# Altium schematic sheet TSI_SAMP_SAMI_V3.4.SchDoc (part 1 of 2)
size 863 x 558 mm; SheetNumber: 1; SheetTotal: 1
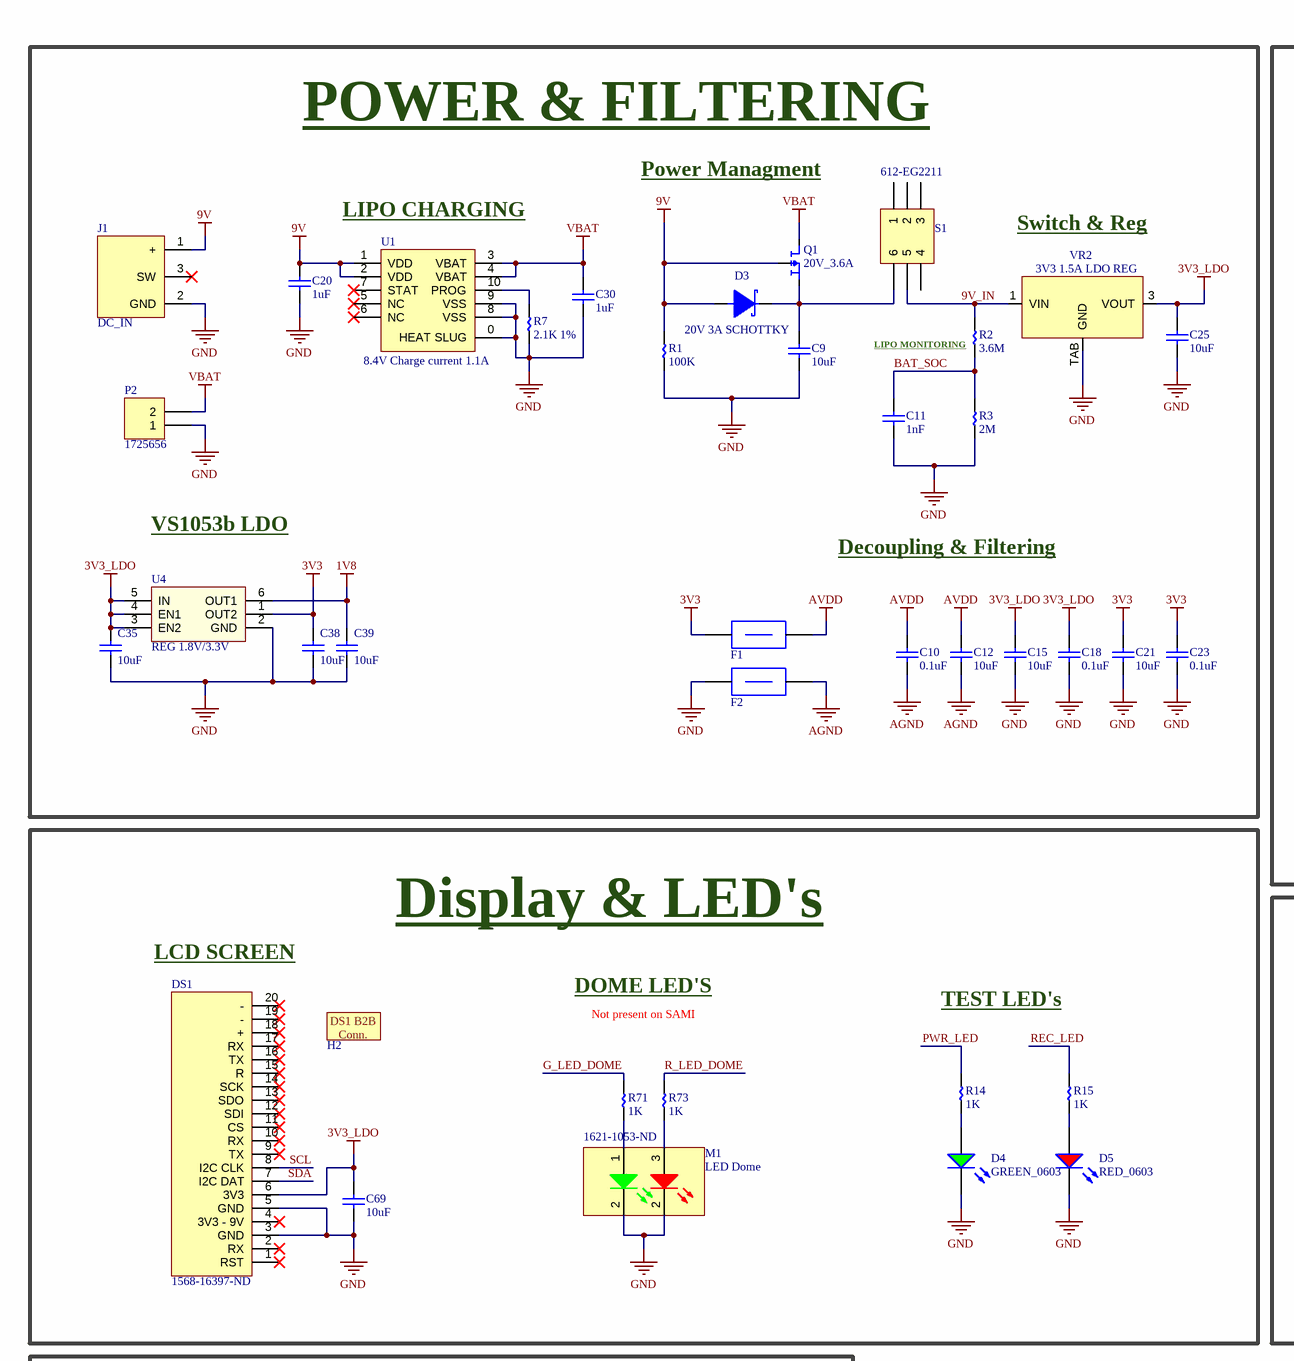
[diagram p0: TSI_SAMP_SAMI_V3.4.SchDoc, top left]
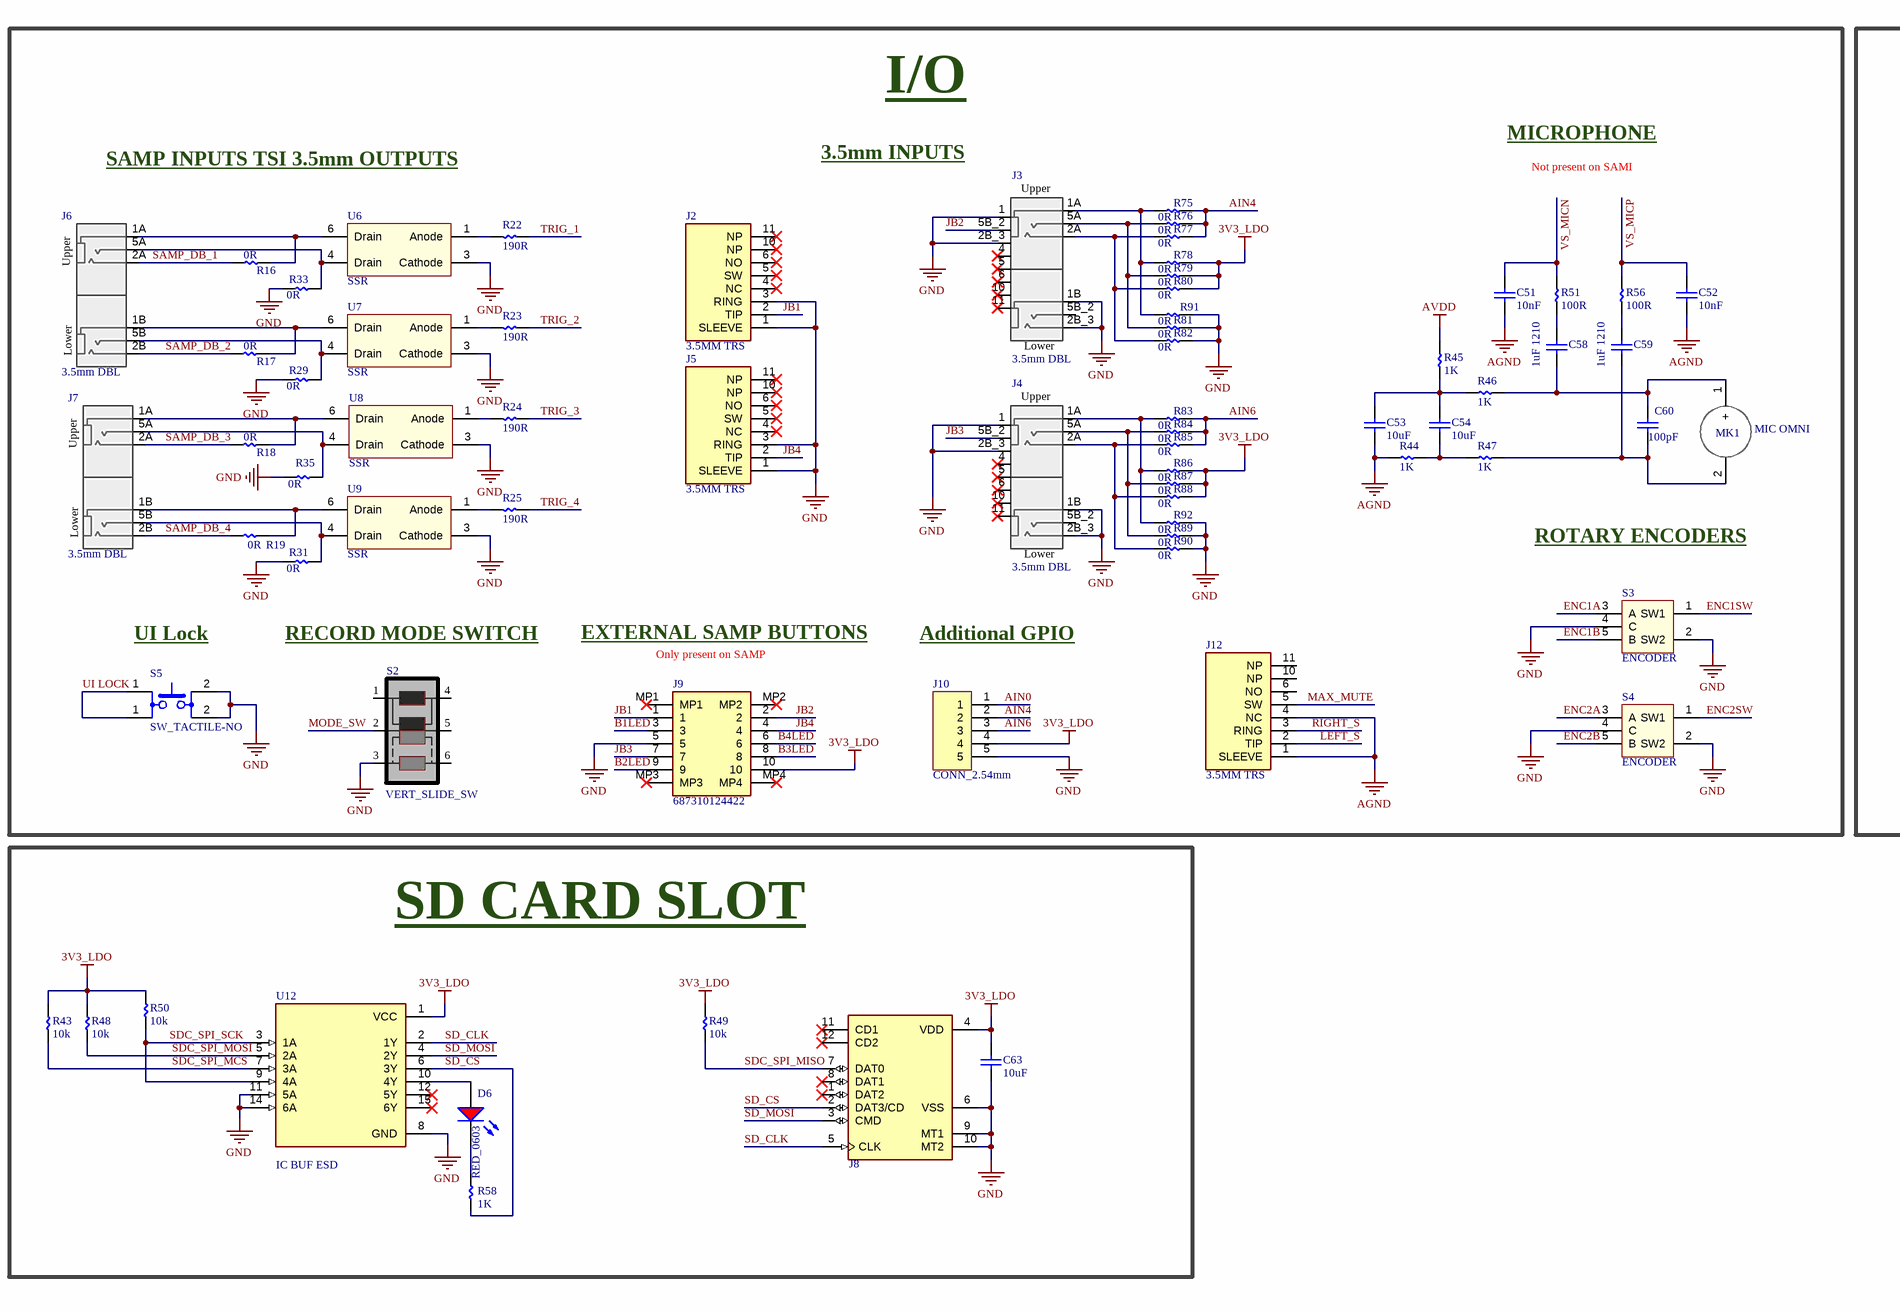
[diagram p1: TSI_SAMP_SAMI_V3.4.SchDoc, top middle]
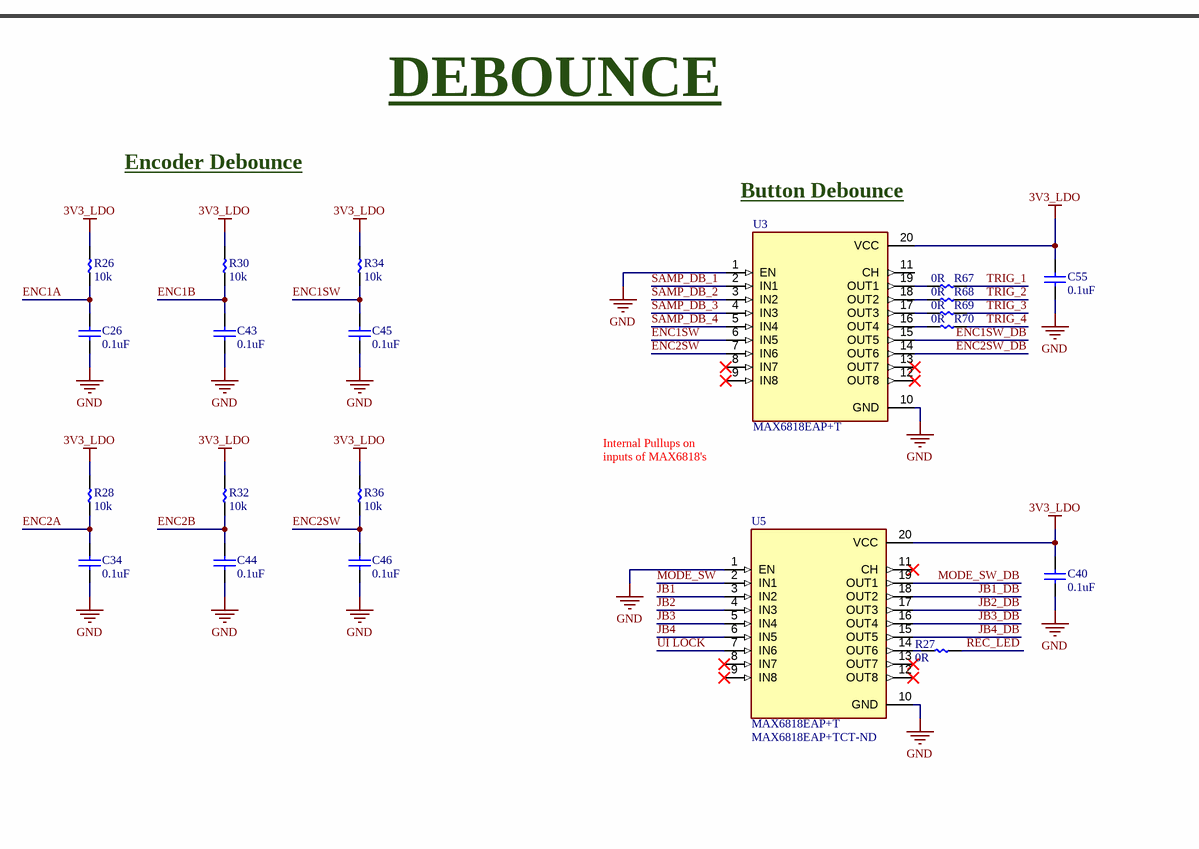
[diagram p2: TSI_SAMP_SAMI_V3.4.SchDoc, top right]
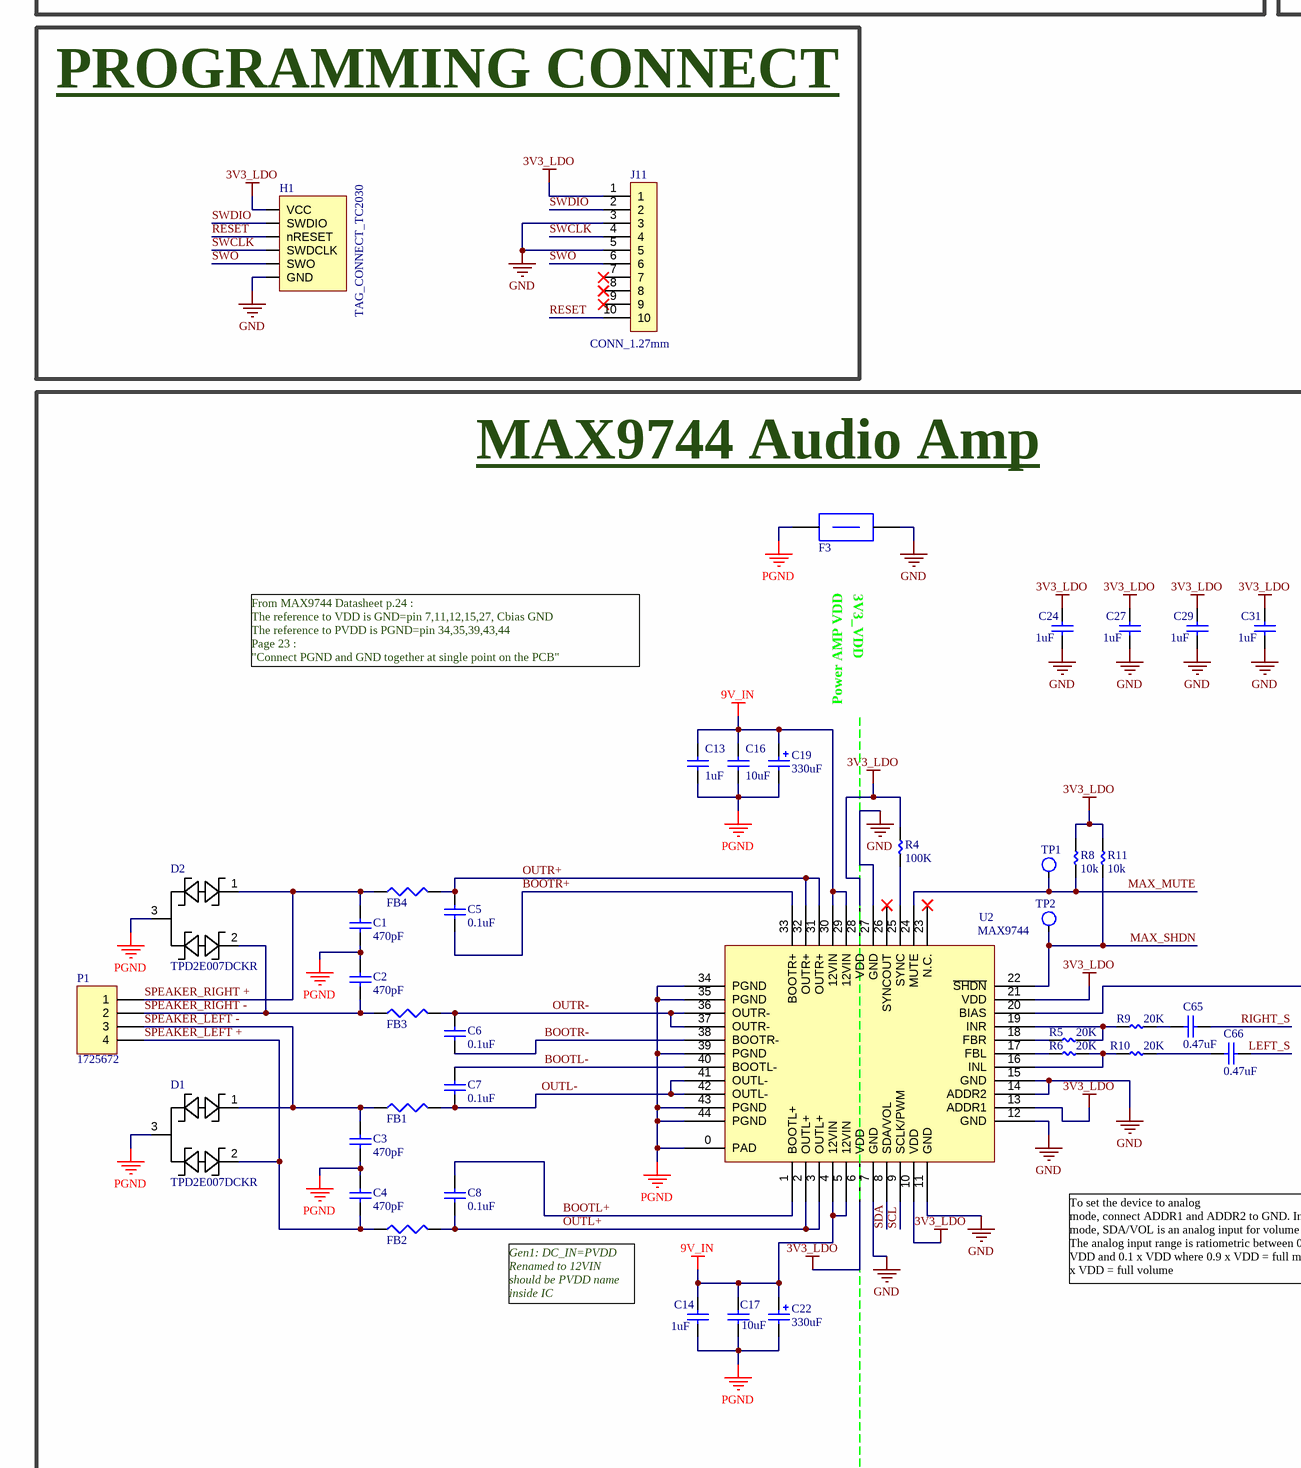
[diagram p3: TSI_SAMP_SAMI_V3.4.SchDoc, bottom left]
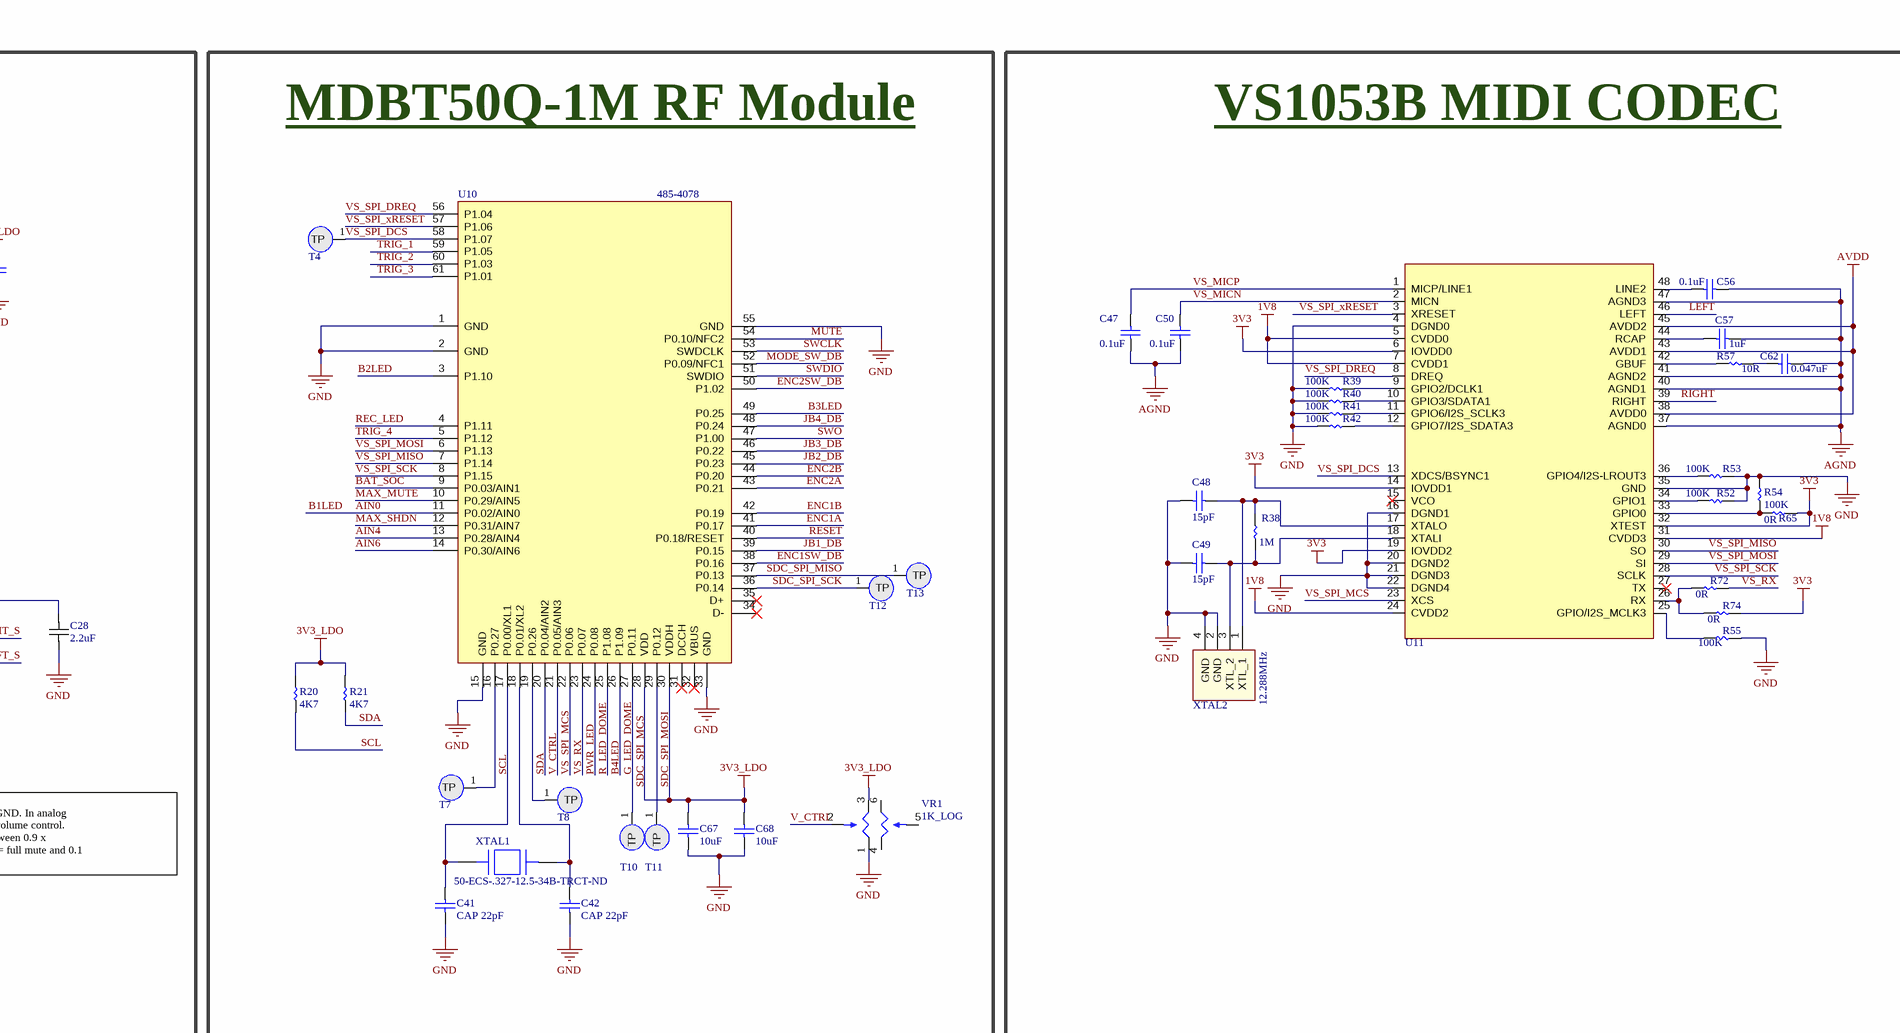
[diagram p4: TSI_SAMP_SAMI_V3.4.SchDoc, bottom middle]
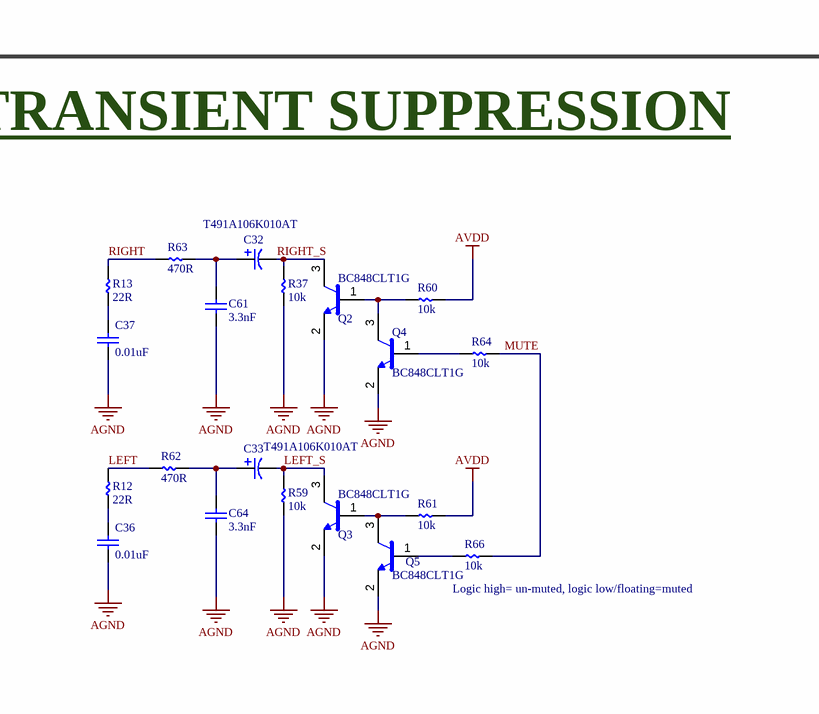
[diagram p5: TSI_SAMP_SAMI_V3.4.SchDoc, bottom right]

## Parts
C1  470pF  [Cap_0603_M]
C2  470pF  [Cap_0603_M]
C3  470pF  [Cap_0603_M]
C4  470pF  [Cap_0603_M]
C5  0.1uF  [Cap_0603_M]
C6  0.1uF  [Cap_0603_M]
C7  0.1uF  [Cap_0603_M]
C8  0.1uF  [Cap_0603_M]
C9  10uF  [Cap_0603_M]
C10  0.1uF  [Cap_0603_M]
C11  1nF  [Cap_0603_M]
C12  10uF  [Cap_0603_M]
C13  1uF  [Cap_0603_M]
C14  1uF  [Cap_0603_M]
C15  10uF  [Cap_0603_M]
C16  10uF  [CAP-1206]
C17  10uF  [CAP-1206]
C18  0.1uF  [Cap_0603_M]
C19  330uF  [CAP ALUM 330UF 20% 50V SMD]
C20  1uF  [Cap_0603_M]
C21  10uF  [Cap_0603_M]
C22  330uF  [CAP ALUM 330UF 20% 50V SMD]
C23  0.1uF  [Cap_0603_M]
C24  1uF  [Cap_0603_M]
C25  10uF  [Cap_0603_M]
C26  0.1uF  [Cap_0603_M]
C27  1uF  [Cap_0603_M]
C28  2.2uF  [Cap_0603_M]
C29  1uF  [Cap_0603_M]
C30  1uF  [Cap_0603_M]
C31  1uF  [Cap_0603_M]
C32  T491A106K010AT  [CAPMP3.4X1.6_1.8N_KEM-M]
C33  T491A106K010AT  [CAPMP3.4X1.6_1.8N_KEM-M]
C34  0.1uF  [Cap_0603_M]
C35  10uF  [Cap_0603_M]
C36  0.01uF  [Cap_0603_M]
C37  0.01uF  [Cap_0603_M]
C38  10uF  [Cap_0603_M]
C39  10uF  [Cap_0603_M]
C40  0.1uF  [Cap_0603_M]
C41  CAP 22pF  [Cap_0603_M]
C42  CAP 22pF  [Cap_0603_M]
C43  0.1uF  [Cap_0603_M]
C44  0.1uF  [Cap_0603_M]
C45  0.1uF  [Cap_0603_M]
C46  0.1uF  [Cap_0603_M]
C47  0.1uF  [Cap_0603_M]
C48  15pF  [Cap_0603_M]
C49  15pF  [Cap_0603_M]
C50  0.1uF  [Cap_0603_M]
C51  10nF  [Cap_0603_M]
C52  10nF  [Cap_0603_M]
C53  10uF  [Cap_0603_M]
C54  10uF  [Cap_0603_M]
C55  0.1uF  [Cap_0603_M]
C56  0.1uF  [Cap_0603_M]
C57  1uF  [Cap_0603_M]
C58  1uF 1210  [CAP_1210_N]
C59  1uF 1210  [CAP_1210_N]
C60  100pF  [Cap_0603_M]
C61  3.3nF  [Cap_0603_M]
C62  0.047uF  [Cap_0603_M]
C63  10uF  [Cap_0603_M]
C64  3.3nF  [Cap_0603_M]
C65  0.47uF  [Cap_0603_M]
C66  0.47uF  [Cap_0603_M]
C67  10uF  [Cap_0603_M]
C68  10uF  [Cap_0603_M]
C69  10uF  [Cap_0603_M]
D1  TPD2E007DCKR  [SOT-SC70]
D2  TPD2E007DCKR  [SOT-SC70]
D3  20V 3A SCHOTTKY  [SCHOTTKY_20V_3A_SMB]
D4  GREEN_0603  [LED_0603_SMD]
D5  RED_0603  [LED_0603_SMD]
D6  RED_0603  [LED_0603_SMD]
DS1  Supplier Part Number 1: 1568-16397-ND  [LCD_Screen_16x2]  (hidden comment: LCD_Screen_16x2)
F1  FERRITE BEAD  [FER_8A_4mOHM_0603]  (value not drawn)
F2  FERRITE BEAD  [FER_8A_4mOHM_0603]  (value not drawn)
F3  FERRITE BEAD  [FER_8A_4mOHM_0603]  (value not drawn)
FB1  220R 3A  [FB_0805]  (value not drawn)
FB2  220R 3A  [FB_0805]  (value not drawn)
FB3  220R 3A  [FB_0805]  (value not drawn)
FB4  220R 3A  [FB_0805]  (value not drawn)
H1  TAG_CONNECT_TC2030  [TAG_CONNECT_TC2030]
H2  16-Pin_B2B  (value not drawn)  (mechanical)
J1  DC_IN  [CONN_DC_JACK_2.1mmID_5.5mmOD_RA_TH]
J2  3.5MM TRS  [CONN_JACK_STEREO_3.5MM_SPDT_RA]
J3  3.5mm DBL  [CONN_3.5MM_COMBO]
J4  3.5mm DBL  [CONN_3.5MM_COMBO]
J5  3.5MM TRS  [CONN_JACK_STEREO_3.5MM_SPDT_RA]
J6  3.5mm DBL  [CONN_3.5MM_STEREO_DBL_VERT_TH]
J7  3.5mm DBL  [CONN_3.5MM_STEREO_DBL_VERT_TH]
J8  CONN_SD_CARD_SMD  [CONN_SD_CARD_SMD]  (value not drawn)
J9  687310124422  [687310124422]
J10  CONN_2.54mm  [HDRV5W67P0X254_1X5_1270X241X858P]
J11  CONN_1.27mm  [CONN_10x_3220-10-0300-00]
J12  3.5MM TRS  [CONN_JACK_STEREO_3.5MM_SPDT_RA]
M1  LED Dome  Supplier Part Number 1: 1621-1053-ND  [LED_Dome_4LED]
MK1  MIC OMNI  [MIC_ELECTRET_CASTLE PAD]
P1  1725672  [1725672]
P2  1725656  [1725656]
Q1  20V_3.6A  [MOSFET_P-CH_20V_SOT23]
Q2  BC848CLT1G  [onSemi_SOT-23_N]
Q3  BC848CLT1G  [onSemi_SOT-23_N]
Q4  BC848CLT1G  [onSemi_SOT-23_N]
Q5  BC848CLT1G  [onSemi_SOT-23_N]
R1  100K  [Res_0603_M]
R2  3.6M  [Res_0603_M]
R3  2M  [Res_0603_M]
R4  100K  [Res_0603_M]
R5  20K  [Res_0603_M]
R6  20K  [Res_0603_M]
R7  2.1K 1%  [Res_0603_M]
R8  10k  [Res_0603_M]
R9  20K  [Res_0603_M]
R10  20K  [Res_0603_M]
R11  10k  [Res_0603_M]
R12  22R  [Res_0603_M]
R13  22R  [Res_0603_M]
R14  1K  [Res_0603_M]
R15  1K  [Res_0603_M]
R16  0R  [Res_0603_M]
R17  0R  [Res_0603_M]
R18  0R  [Res_0603_M]
R19  0R  [Res_0603_M]
R20  4K7  [Res_0603_M]
R21  4K7  [Res_0603_M]
R22  190R  [Res_0603_M]
R23  190R  [Res_0603_M]
R24  190R  [Res_0603_M]
R25  190R  [Res_0603_M]
R26  10k  [Res_0603_M]
R27  0R  [Res_0603_M]
R28  10k  [Res_0603_M]
R29  0R  [Res_0603_M]
R30  10k  [Res_0603_M]
R31  0R  [Res_0603_M]
R32  10k  [Res_0603_M]
R33  0R  [Res_0603_M]
R34  10k  [Res_0603_M]
R35  0R  [Res_0603_M]
R36  10k  [Res_0603_M]
R37  10k  [Res_0603_M]
R38  1M  [Res_0603_M]
R39  100K  [Res_0603_M]
R40  100K  [Res_0603_M]
R41  100K  [Res_0603_M]
R42  100K  [Res_0603_M]
R43  10k  [Res_0603_M]
R44  1K  [Res_0603_M]
R45  1K  [Res_0603_M]
R46  1K  [Res_0603_M]
R47  1K  [Res_0603_M]
R48  10k  [Res_0603_M]
R49  10k  [Res_0603_M]
R50  10k  [Res_0603_M]
R51  100R  [Res_0603_M]
R52  100K  [Res_0603_M]
R53  100K  [Res_0603_M]
R54  100K  [Res_0603_M]
R55  100K  [Res_0603_M]
R56  100R  [Res_0603_M]
R57  10R  [Res_0603_M]
R58  1K  [Res_0603_M]
R59  10k  [Res_0603_M]
R60  10k  [Res_0603_M]
R61  10k  [Res_0603_M]
R62  470R  [Res_0603_M]
R63  470R  [Res_0603_M]
R64  10k  [Res_0603_M]
R65  0R  [Res_0603_M]
R66  10k  [Res_0603_M]
R67  0R  [Res_0603_M]
R68  0R  [Res_0603_M]
R69  0R  [Res_0603_M]
R70  0R  [Res_0603_M]
R71  1K  [Res_0603_M]
R72  0R  [Res_0603_M]
R73  1K  [Res_0603_M]
R74  0R  [Res_0603_M]
R75  0R  [Res_0603_M]
R76  0R  [Res_0603_M]
R77  0R  [Res_0603_M]
R78  0R  [Res_0603_M]
R79  0R  [Res_0603_M]
R80  0R  [Res_0603_M]
R81  0R  [Res_0603_M]
R82  0R  [Res_0603_M]
R83  0R  [Res_0603_M]
R84  0R  [Res_0603_M]
R85  0R  [Res_0603_M]
R86  0R  [Res_0603_M]
R87  0R  [Res_0603_M]
R88  0R  [Res_0603_M]
R89  0R  [Res_0603_M]
R90  0R  [Res_0603_M]
R91  0R  [Res_0603_M]
R92  0R  [Res_0603_M]
S1  Supplier Part Number 1: 612-EG2211  [SW_SLIDE_RA_TH_DPDT]  (hidden comment: SWITCH SLIDE DPDT 200MA 30V)
S2  VERT_SLIDE_SW  [SW_SLIDE_SPDT_VERT_TH]
S3  ENCODER  [ENC_ROTARY_20PPR_TH]
S4  ENCODER  [ENC_ROTARY_20PPR_TH]
S5  SW_TACTILE-NO  [SW_TACTILE_SPST-NO]
T4  CONN_TP_SMD  [CONN_TP_SMD]  (value not drawn)
T7  CONN_TP_SMD  [CONN_TP_SMD]  (value not drawn)
T8  CONN_TP_SMD  [CONN_TP_SMD]  (value not drawn)
T10  CONN_TP_SMD  [CONN_TP_SMD]  (value not drawn)
T11  CONN_TP_SMD  [CONN_TP_SMD]  (value not drawn)
T12  CONN_TP_SMD  [CONN_TP_SMD]  (value not drawn)
T13  CONN_TP_SMD  [CONN_TP_SMD]  (value not drawn)
TP1  Test Point  [TEST POINT ROUND SMD 0.6mm]  (value not drawn)  (no BOM)
TP2  Test Point  [TEST POINT ROUND SMD 0.6mm]  (value not drawn)  (no BOM)
U1  8.4V Charge current 1.1A  [LIPO-CHARGING_8.4V_10DFN]
U2  MAX9744  [MAX9744_T4477]
U3  MAX6818EAP+T  [IC_DEBOUNCE_8IN8OUT_SMD]
U4  REG 1.8V/3.3V  [IC_REG_LINEAR_3V3_1V8_SMD]
U5  MAX6818EAP+T  Supplier Part Number 1: MAX6818EAP+TCT-ND  [IC_DEBOUNCE_8IN8OUT_SMD]
U6  SSR  [IC_SSR_NO_SMD]
U7  SSR  [IC_SSR_NO_SMD]
U8  SSR  [IC_SSR_NO_SMD]
U9  SSR  [IC_SSR_NO_SMD]
U10  Supplier Part Number 1: 485-4078  [IC_MDBT50Q-1M_SMD]  (hidden comment: IC_MDBT50Q-1M_SMD)
U11  IC_VS1053B_LQFP48  [IC_VS1053B_LQFP48]  (value not drawn)
U12  IC BUF ESD  [IC_BUF_ESD_CD74HC4050MT]
VR1  1K_LOG  [POT_1K_LOG_TH_RA]
VR2  3V3 1.5A LDO REG  [REG_3.3V_D2PAK]
XTAL1  50-ECS-.327-12.5-34B-TRCT-ND  [XTAL-32.768kHz]
XTAL2  12.288MHz  [XTAL_12.288MHz_SMD]

## Blocks framed on the sheet
POWER & FILTERING: C9-C12 C15 C18 C20 C21 C23 C25 C30 C35 C38 C39 D3 F1 F2 J1 P2 Q1 R1-R3 R7 S1 U1 U4 VR2
I/O: C51-C54 C58-C60 J2-J7 J9 J10 J12 MK1 R16-R19 R22-R25 R29 R31 R33 R35 R44-R47 R51 R56 R75-R92 S2-S5 U6-U9
DEBOUNCE: C26 C34 C40 C43-C46 C55 R26-R28 R30 R32 R34 R36 R67-R70 U3 U5
Display & LED's: C69 D4 D5 DS1 H2 M1 R14 R15 R71 R73
SD CARD SLOT: C63 D6 J8 R43 R48-R50 R58 U12
PROGRAMMING CONNECT: H1 J11
MAX9744 Audio Amp: C1-C8 C13 C14 C16 C17 C19 C22 C24 C27-C29 C31 C65 C66 D1 D2 F3 FB1-FB4 P1 R4-R6 R8-R11 TP1 TP2 U2
MDBT50Q-1M RF Module: C41 C42 C67 C68 R20 R21 T4 T7 T8 T10-T13 U10 VR1 XTAL1
VS1053B MIDI CODEC: C47-C50 C56 C57 C62 R38-R42 R52-R55 R57 R65 R72 R74 U11 XTAL2
TRANSIENT SUPPRESSION: C32 C33 C36 C37 C61 C64 Q2-Q5 R12 R13 R37 R59-R64 R66

## Nets
1V8: C39.2 U4.6(OUT1) U11.5(CVDD0) U11.7(CVDD1) U11.24(CVDD2) U11.31(CVDD3)
3V3: C21.2 C23.2 C38.2 F1.1 R65.2 R74.2 U4.1(OUT2) U11.6(IOVDD0) U11.14(IOVDD1) U11.19(IOVDD2) U11.32(XTEST)
3V3_LDO: C15.2 C18.2 C24.2 C25.2 C27.2 C29.2 C31.2 C35.2 C40.2 C55.2 C63.2 C67.2 C68.2 C69.2 DS1.6(3V3) H1.1(VCC) J8.4(VDD) J9.10 J10.4 J11.1 R4.2 R8.1 R11.1 R20.1 R21.1 R26.1 R28.1 R30.1 R32.1 R34.1 R36.1 R43.1 R48.1 R49.1 R50.1 R78.2 R79.2 R80.2 R86.2 R87.2 R88.2 U2.6(VDD) U2.10(VDD) U2.13(ADDR1) U2.21(VDD) U2.28(VDD) U3.20(VCC) U4.3(EN2) U4.4(EN1) U4.5(IN) U5.20(VCC) U10.28(VDD) U10.30(VDDH) U12.1(VCC) VR1.3 VR2.3(VOUT)
9V: C20.2 D3.1(ANODE) J1.1(+) Q1.1(G) R1.1 U1.1(VDD) U1.2(VDD)
9V_IN: C13.2 C14.2 C16.2 C17.2 C19.1 C22.1 R2.1 S1.5 U2.4(12VIN) U2.5(12VIN) U2.29(12VIN) U2.30(12VIN) VR2.1(VIN)
AGND: C10.1 C12.1 C36.1 C37.1 C47.1 C50.1 C51.1 C52.1 C53.1 C56.2 C57.2 C61.1 C62.1 C64.1 F2.2 J12.1(SLEEVE) J12.4(NC) Q2.2(E) Q3.2(E) Q4.2(E) Q5.2(E) R37.2 R44.2 R59.2 U11.37(AGND0) U11.40(AGND1) U11.41(AGND2) U11.47(AGND3)
AVDD: C10.2 C12.2 F1.2 R45.1 R60.2 R61.2 U11.38(AVDD0) U11.43(AVDD1) U11.45(AVDD2)
GND: C9.1 C11.1 C15.1 C18.1 C20.1 C21.1 C23.1 C24.1 C25.1 C26.1 C27.1 C28.1 C29.1 C30.1 C31.1 C34.1 C35.1 C38.1 C39.1 C40.1 C41.1 C42.1 C43.1 C44.1 C45.1 C46.1 C48.1 C49.2 C55.1 C63.1 C67.1 C68.1 C69.1 D4.2(K) D5.2(K) DS1.3(GND) DS1.5(GND) F2.1 F3.2 H1.5(GND) J1.2(GND) J2.1(SLEEVE) J2.3(RING) J3.1 J3.1B J3.2B_3 J4.1 J4.1B J4.2B_3 J5.1(SLEEVE) J5.3(RING) J8.6(VSS) J8.9(MT1) J8.10(MT2) J9.5 J10.5 J11.3 J11.5 M1.2 P2.1 R1.2 R3.2 R7.2 R29.1 R31.1 R33.1 R35.1 R39.2 R40.2 R41.2 R42.2 R52.1 R53.1 R54.1 R55.1 R81.2 R82.2 R89.2 R90.2 R91.2 R92.2 S2.3 S3.2(SW2) S3.4(C) S4.2(SW2) S4.4(C) S5.2 U1.0(HEAT_SLUG) U1.8(VSS) U1.9(VSS) U2.7(GND) U2.11(GND) U2.12(GND) U2.14(ADDR2) U2.15(GND) U2.27(GND) U3.1(EN) U3.10(GND) U4.2(GND) U5.1(EN) U5.10(GND) U6.3(Cathode) U7.3(Cathode) U8.3(Cathode) U9.3(Cathode) U10.1(GND) U10.2(GND) U10.15(GND) U10.33(GND) U10.55(GND) U11.4(DGND0) U11.16(DGND1) U11.20(DGND2) U11.21(DGND3) U11.22(DGND4) U11.35(GND) U12.8(GND) U12.11(5A) U12.14(6A) VR1.1 VR2.TAB(GND) XTAL2.2(GND) XTAL2.4(GND)
PGND: C1.1 C2.2 C3.1 C4.2 C13.1 C14.1 C16.1 C17.1 C19.2 C22.2 D1.3(GND) D2.3(GND) F3.1 U2.0(PAD) U2.34(PGND) U2.35(PGND) U2.39(PGND) U2.43(PGND) U2.44(PGND)
VBAT: C30.2 P2.2 Q1.2(S) U1.3(VBAT) U1.4(VBAT)
AIN0: J9.3 J10.1 U10.11(P0.02/AIN0)  [also labelled B1LED]
AIN4: J10.2 R75.2 R76.2 R77.2 U10.13(P0.28/AIN4)
AIN6: J10.3 R83.2 R84.2 R85.2 U10.14(P0.30/AIN6)
B2LED: J9.9 U10.3(P1.10)
B3LED: J9.8 U10.49(P0.25)
B4LED: J9.6 U10.25(P1.08)
BAT_SOC: C11.2 R2.2 R3.1 U10.9(P0.03/AIN1)
BOOTL+: C8.2 U2.1(BOOTL+)
BOOTL-: C7.2 U2.40(BOOTL-)
BOOTR+: C5.1 U2.33(BOOTR+)
BOOTR-: C6.1 U2.38(BOOTR-)
ENC1A: C26.2 R26.2 S3.3(A) U10.41(P0.17)
ENC1B: C43.2 R30.2 S3.5(B) U10.42(P0.19)
ENC1SW: C45.2 R34.2 S3.1(SW1) U3.6(IN5)
ENC1SW_DB: U3.15(OUT5) U10.38(P0.16)
ENC2A: C34.2 R28.2 S4.3(A) U10.43(P0.21)
ENC2B: C44.2 R32.2 S4.5(B) U10.44(P0.20)
ENC2SW: C46.2 R36.2 S4.1(SW1) U3.7(IN6)
ENC2SW_DB: U3.14(OUT6) U10.50(P1.02)
G_LED_DOME: R71.1 U10.26(P1.09)
JB1: J2.2(TIP) J9.1 U5.3(IN2)
JB1_DB: U5.18(OUT2) U10.39(P0.15)
JB2: J3.5B_2 J9.2 U5.4(IN3)
JB2_DB: U5.17(OUT3) U10.45(P0.23)
JB3: J4.5B_2 J9.7 U5.5(IN4)
JB3_DB: U5.16(OUT4) U10.46(P0.22)
JB4: J5.2(TIP) J9.4 U5.6(IN5)
JB4_DB: U5.15(OUT5) U10.48(P0.24)
LEFT: R12.1 R62.2 U11.46(LEFT)
LEFT_S: C33.2 C66.1 J12.2(TIP) Q3.3(C) R59.1
MAX_MUTE: J12.5(SW) R8.2 TP1.1 U2.24(MUTE) U10.10(P0.29/AIN5)
MAX_SHDN: R11.2 TP2.1 U2.22(~{SHDN}) U10.12(P0.31/AIN7)
MODE_SW: S2.2 U5.2(IN1)
MODE_SW_DB: U5.19(OUT1) U10.52(P0.09/NFC1)
MUTE: R64.2 R66.2 U10.54(P0.10/NFC2)
OUTL+: C8.1 FB2.2 U2.2(OUTL+) U2.3(OUTL+)
OUTL-: C7.1 FB1.2 U2.41(OUTL-) U2.42(OUTL-)
OUTR+: C5.2 FB4.2 U2.31(OUTR+) U2.32(OUTR+)
OUTR-: C6.2 FB3.2 U2.36(OUTR-) U2.37(OUTR-)
PWR_LED: R14.2 U10.23(P0.07)
R_LED_DOME: R73.1 U10.24(P0.08)
REC_LED: R15.2 R27.2 U10.4(P1.11)
RESET: H1.3(nRESET) J11.10 U10.40(P0.18/RESET)
RIGHT: R13.1 R63.2 U11.39(RIGHT)
RIGHT_S: C32.2 C65.1 J12.3(RING) Q2.3(C) R37.1
SAMP_DB_1: J6.2A R16.1 U3.2(IN1)
SAMP_DB_2: J6.2B R17.1 U3.3(IN2)
SAMP_DB_3: J7.2A R18.1 U3.4(IN3)
SAMP_DB_4: J7.2B R19.1 U3.5(IN4)
SCL: DS1.8(I2C_CLK) R20.2 T7.1(TP) U2.9(SCLK/PWM) U10.16(P0.27)
SD_CLK: J8.5(CLK) U12.2(1Y)
SD_CS: J8.2(DAT3/CD) R58.2 U12.6(3Y)
SD_MOSI: J8.3(CMD) U12.4(2Y)
SDA: DS1.7(I2C_DAT) R21.2 T8.1(TP) U2.8(SDA/VOL) U10.19(P0.26)
SDC_SPI_MCS: R43.2 T10.1(TP) U10.27(P0.11) U12.7(3A)
SDC_SPI_MISO: J8.7(DAT0) R49.2 T13.1(TP) U10.37(P0.13)
SDC_SPI_MOSI: R48.2 T11.1(TP) U10.29(P0.12) U12.5(2A)
SDC_SPI_SCK: R50.2 T12.1(TP) U10.36(P0.14) U12.3(1A) U12.9(4A)
SPEAKER_LEFT +: C4.1 D1.2(IO2) FB2.1 P1.4
SPEAKER_LEFT -: C3.2 D1.1(IO1) FB1.1 P1.3
SPEAKER_RIGHT +: C1.2 D2.1(IO1) FB4.1 P1.1
SPEAKER_RIGHT -: C2.1 D2.2(IO2) FB3.1 P1.2
SWCLK: H1.4(SWDCLK) J11.4 U10.53(SWDCLK)
SWDIO: H1.2(SWDIO) J11.2 U10.51(SWDIO)
SWO: H1.6(SWO) J11.6 U10.47(P1.00)
TRIG_1: R22.2 R67.2 U10.59(P1.05)
TRIG_2: R23.2 R68.2 U10.60(P1.03)
TRIG_3: R24.2 R69.2 U10.61(P1.01)
TRIG_4: R25.2 R70.2 U10.5(P1.12)
UI LOCK: S5.1 U5.7(IN6)
V_CTRL: U10.20(P0.04/AIN2) VR1.2
VS_MICN: C50.2 C51.2 R51.1 U11.2(MICN)
VS_MICP: C47.2 C52.2 R56.1 U11.1(MICP/LINE1)
VS_RX: R72.2 U10.22(P0.06)
VS_SPI_DCS: T4.1(TP) U10.58(P1.07) U11.13(XDCS/BSYNC1)
VS_SPI_DREQ: U10.56(P1.04) U11.8(DREQ)
VS_SPI_MCS: U10.21(P0.05/AIN3) U11.23(XCS)
VS_SPI_MISO: U10.7(P1.14) U11.30(SO)
VS_SPI_MOSI: U10.6(P1.13) U11.29(SI)
VS_SPI_SCK: U10.8(P1.15) U11.28(SCLK)
VS_SPI_xRESET: U10.57(P1.06) U11.3(XRESET)
NetC9_2: C9.2 D3.2(CATHODE) Q1.3(D) S1.6
NetC28_2: C28.2 U2.20(BIAS)
NetC32_1: C32.1 C61.2 R63.1
NetC33_1: C33.1 C64.2 R62.1
NetC36_2: C36.2 R12.2
NetC37_2: C37.2 R13.2
NetC41_2: C41.2 U10.17(P0.00/XL1) XTAL1.2
NetC42_2: C42.2 U10.18(P0.01/XL2) XTAL1.1
NetC48_2: C48.2 R38.2 U11.17(XTALO) XTAL2.1(XTL_1)
NetC49_1: C49.1 R38.1 U11.18(XTALI) XTAL2.3(XTL_2)
NetC53_2: C53.2 C54.2 R45.2 R46.2
NetC54_1: C54.1 R44.1 R47.2
NetC56_1: C56.1 U11.48(LINE2)
NetC57_1: C57.1 U11.44(RCAP)
NetC58_1: C58.1 C60.2 MK1.1(+) R46.1
NetC58_2: C58.2 R51.2
NetC59_1: C59.1 C60.1 MK1.2 R47.1
NetC59_2: C59.2 R56.2
NetC62_2: C62.2 R57.2
NetC65_2: C65.2 R9.1
NetC66_2: C66.2 R10.1
NetD4_1: D4.1(A) R14.1
NetD5_1: D5.1(A) R15.1
NetD6_1: D6.1(A) U12.10(4Y)
NetD6_2: D6.2(K) R58.1
NetJ3_1A: J3.1A R75.1 R78.1 R91.1
NetJ3_2A: J3.2A R77.1 R80.1 R82.1
NetJ3_5A: J3.5A R76.1 R79.1 R81.1
NetJ4_1A: J4.1A R83.1 R86.1 R92.1
NetJ4_2A: J4.2A R85.1 R88.1 R90.1
NetJ4_5A: J4.5A R84.1 R87.1 R89.1
NetJ6_1A: J6.1A R16.2 U6.6(Drain)
NetJ6_1B: J6.1B R17.2 U7.6(Drain)
NetJ6_5A: J6.5A R33.2 U6.4(Drain)
NetJ6_5B: J6.5B R29.2 U7.4(Drain)
NetJ7_1A: J7.1A R18.2 U8.6(Drain)
NetJ7_1B: J7.1B R19.2 U9.6(Drain)
NetJ7_5A: J7.5A R35.2 U8.4(Drain)
NetJ7_5B: J7.5B R31.2 U9.4(Drain)
NetM1_1: M1.1 R71.2
NetM1_3: M1.3 R73.2
NetQ2_1: Q2.1(B) Q4.3(C) R60.1
NetQ3_1: Q3.1(B) Q5.3(C) R61.1
NetQ4_1: Q4.1(B) R64.1
NetQ5_1: Q5.1(B) R66.1
NetR4_1: R4.1 U2.25(SYNC)
NetR5_1: R5.1 R9.2 U2.19(INR)
NetR5_2: R5.2 U2.18(FBR)
NetR6_1: R6.1 R10.2 U2.16(INL)
NetR6_2: R6.2 U2.17(FBL)
NetR7_1: R7.1 U1.10(PROG)
NetR22_1: R22.1 U6.1(Anode)
NetR23_1: R23.1 U7.1(Anode)
NetR24_1: R24.1 U8.1(Anode)
NetR25_1: R25.1 U9.1(Anode)
NetR27_1: R27.1 U5.14(OUT6)
NetR39_1: R39.1 U11.9(GPIO2/DCLK1)
NetR40_1: R40.1 U11.10(GPIO3/SDATA1)
NetR41_1: R41.1 U11.11(GPIO6/I2S_SCLK3)
NetR42_1: R42.1 U11.12(GPIO7/I2S_SDATA3)
NetR52_2: R52.2 U11.34(GPIO1)
NetR53_2: R53.2 U11.36(GPIO4/I2S-LROUT3)
NetR54_2: R54.2 R65.1 U11.33(GPIO0)
NetR55_2: R55.2 U11.25(GPIO/I2S_MCLK3)
NetR57_1: R57.1 U11.42(GBUF)
NetR67_1: R67.1 U3.19(OUT1)
NetR68_1: R68.1 U3.18(OUT2)
NetR69_1: R69.1 U3.17(OUT3)
NetR70_1: R70.1 U3.16(OUT4)
NetR72_1: R72.1 R74.1 U11.26(RX)

Not connected (* = marked no-connect by the designer): DS1 1(RST)* 2(RX)* 4(3V3_-_9V)* 9(TX)* 10(RX)* 11(CS)* 12(SDI)* 13(SDO)* 14(SCK)* 15(R)* 16(TX)* 17(RX)* 18(+)* 19(-)* 20(-)*; J1 3(SW)*; J2 4(NC)* 5(SW)* 6(NO)* 10(NP)* 11(NP)*; J3 4* 5* 6* 10* 11*; J4 4* 5* 6* 10* 11*; J5 4(NC)* 5(SW)* 6(NO)* 10(NP)* 11(NP)*; J8 1(DAT2)* 8(DAT1)* 11(CD1)* 12(CD2)*; J9 MP1* MP2* MP3* MP4*; J11 7* 8* 9*; J12 6(NO) 10(NP) 11(NP); S1 1 2 3 4; S2 1 4 5 6; U1 5(NC)* 6(NC)* 7(STAT)*; U2 23(N.C.)* 26(SYNCOUT)*; U3 8(IN7)* 9(IN8)* 11(CH) 12(OUT8)* 13(OUT7)*; U5 8(IN7)* 9(IN8)* 11(CH)* 12(OUT8)* 13(OUT7)*; U10 31(DCCH)* 32(VBUS)* 34(D-)* 35(D+)*; U11 15(VCO)* 27(TX)*; U12 12(5Y)* 15(6Y)*; VR1 4 5 6

## Notes on the sheet
- MICROPHONE
- (near U1) LIPO CHARGING
- Power Managment
- Switch & Reg
- SAMP INPUTS TSI 3.5mm OUTPUTS
- 3.5mm INPUTS
- Not present on SAMI
- Encoder Debounce
- (near U3) Button Debounce
- (near R2) LIPO MONITORING
- VS1053b LDO
- Decoupling & Filtering
- Internal Pullups on inputs of MAX6818's
- ROTARY ENCODERS
- (near S5) UI Lock
- RECORD MODE SWITCH
- EXTERNAL SAMP BUTTONS
- Additional GPIO
- (near J9) Only present on SAMP
- (near DS1) LCD SCREEN
- DOME LED'S
- TEST LED's
- Power AMP VDD
- 3V3_VDD
- From MAX9744 Datasheet p.24 :
  The reference to VDD is GND=pin 7,11,12,15,27, Cbias GND
  The reference to PVDD is PGND=pin 34,35,39,43,44
  Page 23 :
  "Connect PGND and GND together at single point on the PCB"
- (near R66) Logic high= un-muted, logic low/floating=muted
- Gen1: DC_IN=PVDD
  Renamed to 12VIN
  should be PVDD name inside IC
- To set the device to analog
  mode, connect ADDR1 and ADDR2 to GND. In analog
  mode, SDA/VOL is an analog input for volume control.
  The analog input range is ratiometric between 0.9 x
  VDD and 0.1 x VDD where 0.9 x VDD = full mute and 0.1
  x VDD = full volume
- DWG. NO.
- REV.
- SHT.
- REVISION
- DESCRIPTION
- DATE
- APPROVED
- THIS DOCUMENT AND THE DATA DISCLOSED HEREIN OR HEREWITH IS THE PROPERTY OF ALTIUM LIMITED AND MAY BE FREELY DISTRIBUTED IN WHOLE. NO RIGHTS ARE RESERVED OR EXPRESS OR IMPLIED WARANTEE GIVEN.
- ENG:
- DSN:
- APPROVALS
- PROJECT
- DOCUMENT REVISION:
- DESIGN ITEM:
- CHK:
- BOM:
- REFERENCE DOCUMENTS
- PROJECT REVISION:
- TITLE
- FAB DWG:
- PCB DWG:
- ASSY DWG:
- SCALE:
- SIZE
- D
- CAGE CODE
- FILE NAME
- DWG NO.
- SHEET
- OF
- REV
- (in symbol 16-Pin_B2B) DS1 B2B Conn.
- (in symbol CONN_3.5MM_COMBO) Upper; Lower
- (in symbol CONN_3.5MM_STEREO_DBL_VERT_TH) Upper; Lower